# EasyEDA Pro project 8CH_ADC_CAPTURE_CARD.epro, board SMA
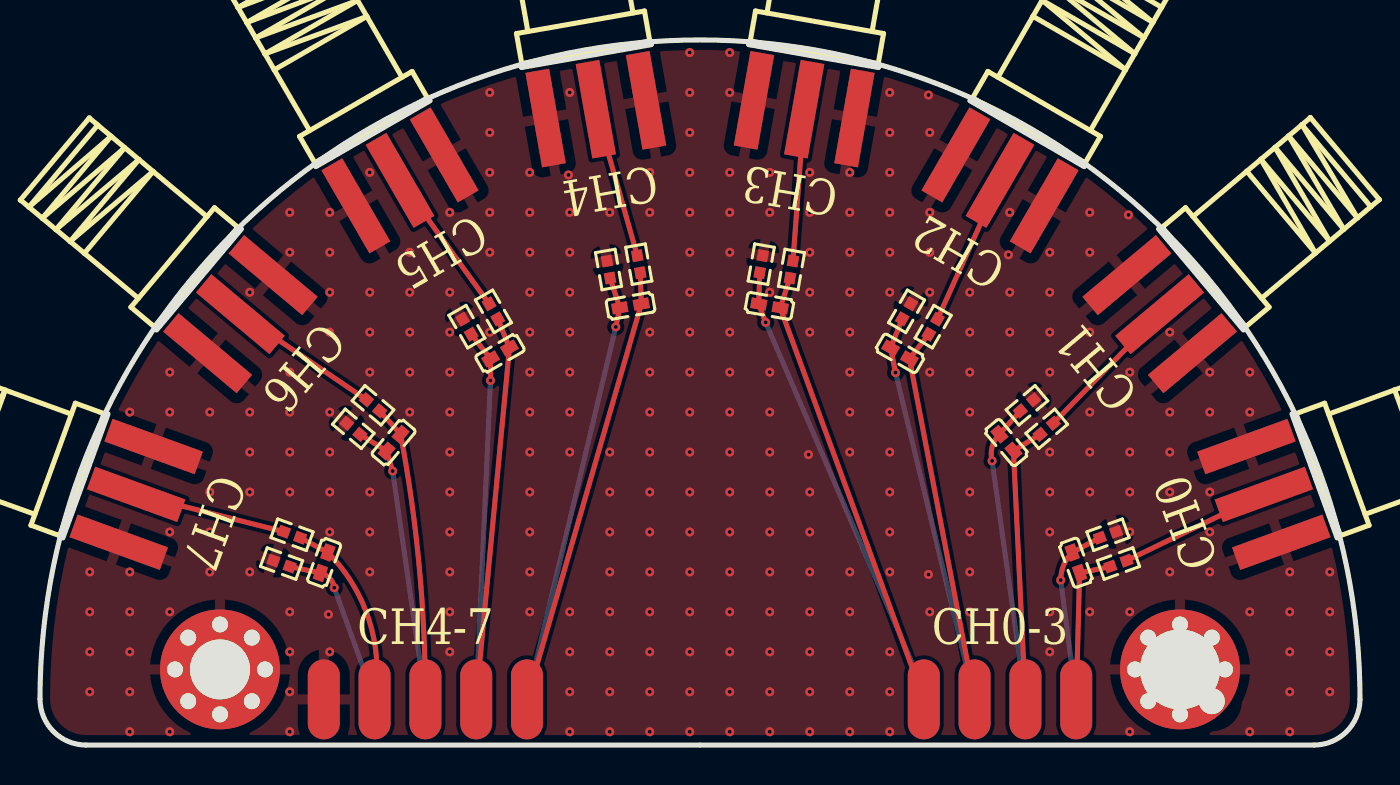
[diagram p14: board, top side]
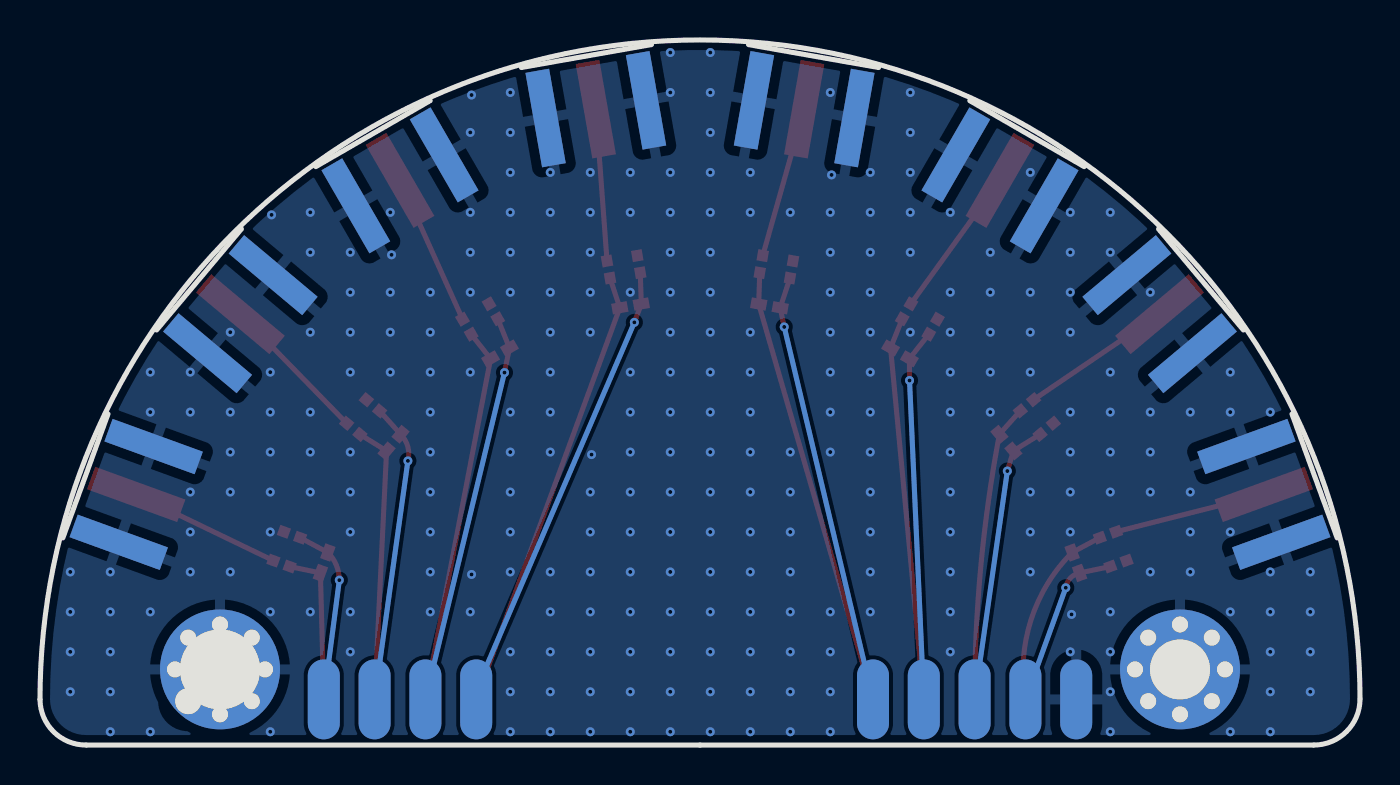
[diagram p15: board, bottom side, seen from below]

Outline 66 x 35.3 mm; copper layers: Top Layer, Inner9, Inner10, Inner11, Inner12, Inner13, Inner14, Inner15, Inner16, Inner17, Inner18, Inner19, Inner20, Inner21, Inner22, Inner23, Inner24, Inner25, Inner26, Inner27, Inner28, Inner29, Inner30, Bottom Layer. Coordinates in mm from the lower left corner of the outline.
Outline path: 0,2.3 arc(33.01,35.3) 66,2.29 arc(65.32,0.67) 63.69,0 2.31,0 arc(0.68,0.67) 0,2.3
Stack: Top Layer 0.035mm / Dielectric1 1.51mm FR4 er 4.5 / Bottom Layer 0.035mm

## Design rules (mm)
template: 自定义配置
spacing copperThickness1oz (default): track to track 0.102, other pairs 0.152 to 0.3
spacing copperThickness2oz: track to track 0.203, other pairs 0.152 to 0.3
track width copperThickness1oz (default): min 0.127, default 0.254, max 2.54
track width copperThickness2oz: min 0.203, default 0.254, max 2.54
differential pair differentialPair (default): width min 0.127, default 0.254, max 2.54; gap min 0.152, default 0.152
via viaSize (default): diameter min 0.4, default 0.45, max 10; hole min 0.2, default 0.2, max 6.3

## Placement (name value [footprint] x y rotation side)
C1  2nF  [C0402]  51.79 9.13 290 top
C2  2nF  [C0402]  48.32 15.14 310 top
C3  2nF  [C0402]  43 19.61 330 top
C4  2nF  [C0402]  36.47 21.98 350 top
C5  2nF  [C0402]  29.53 21.98 10 top
C6  2nF  [C0402]  23 19.61 30 top
C7  2nF  [C0402]  17.68 15.14 50 top
C8  2nF  [C0402]  14.21 9.13 70 top
H1  PZ254V-12-8P  [HDR-TH_8P-P2.54-V-M-R2-C4-S2.54]  48 2.29 180 top
H2  PZ254V-12-10P  [HDR-TH_10P-P2.54-V-M-R2-C5-S2.54]  19.27 2.29 180 top
NOREF  -  [Pad_e3119]  6.75 3.79 45 top
NOREF#2  -  [Pad_e3107]  57 3.79 0 top
NOREF#3  -  [Pad_e3126]  7.41 2.2 45 top
NOREF#4  -  [Pad_e3114]  57 1.54 45 top
NOREF#5  -  [Pad_e3112]  57 6.04 45 top
NOREF#6  -  [Pad_e3125]  9 1.54 45 top
NOREF#7  -  [Pad_e3116]  55.41 2.2 45 top
NOREF#8  -  [Pad_e3109]  9 3.79 0 top
NOREF#9  -  [Pad_e3110]  58.59 2.2 45 top
NOREF#10  -  [Pad_e3121]  9 6.04 45 top
NOREF#11  -  [Pad_e3120]  7.41 5.38 45 top
NOREF#12  -  [Pad_e3117]  59.25 3.79 45 top
NOREF#13  -  [Pad_e3122]  10.59 5.38 45 top
NOREF#14  -  [Pad_e3123]  11.25 3.79 45 top
NOREF#15  -  [Pad_e3113]  55.41 5.38 45 top
NOREF#16  -  [Pad_e3124]  10.59 2.2 45 top
NOREF#17  -  [Pad_e3118]  58.59 5.38 45 top
NOREF#18  -  [Pad_e3115]  54.75 3.79 45 top
R1  330Ω  [R0402]  53.92 9.08 200 top
R2  330Ω  [R0402]  53.4 10.53 200 top
R3  330Ω  [R0402]  50.34 15.83 220 top
R4  330Ω  [R0402]  49.35 17.01 220 top
R5  330Ω  [R0402]  44.66 20.94 240 top
R6  330Ω  [R0402]  43.33 21.71 240 top
R7  330Ω  [R0402]  37.57 23.81 260 top
R8  330Ω  [R0402]  36.06 24.07 260 top
R9  330Ω  [R0402]  29.94 24.07 280 top
R10  330Ω  [R0402]  28.43 23.81 280 top
R11  330Ω  [R0402]  22.67 21.71 300 top
R12  330Ω  [R0402]  21.34 20.94 300 top
R13  330Ω  [R0402]  16.65 17.01 320 top
R14  330Ω  [R0402]  15.66 15.83 320 top
R15  330Ω  [R0402]  12.6 10.53 340 top
R16  330Ω  [R0402]  12.08 9.08 340 top
RF1  BWSMA-KE-P001  [SMA-SMD_BWSMA-KE-P001]  61.19 12.55 20 top
RF2  BWSMA-KE-P001  [SMA-SMD_BWSMA-KE-P001]  55.98 21.57 40 top
RF3  BWSMA-KE-P001  [SMA-SMD_BWSMA-KE-P001]  48 28.27 60 top
RF4  BWSMA-KE-P001  [SMA-SMD_BWSMA-KE-P001]  38.21 31.83 80 top
RF5  BWSMA-KE-P001  [SMA-SMD_BWSMA-KE-P001]  27.79 31.83 100 top
RF6  BWSMA-KE-P001  [SMA-SMD_BWSMA-KE-P001]  18 28.27 120 top
RF7  BWSMA-KE-P001  [SMA-SMD_BWSMA-KE-P001]  10.02 21.57 140 top
RF8  BWSMA-KE-P001  [SMA-SMD_BWSMA-KE-P001]  4.81 12.55 160 top

## Footprints (pads in the part's own frame, mm; a bottom-side part is the same pattern mirrored in y, then rotated)
C0402
  rect 0.79x0.54 smd: 1(-0.545,0) 2(0.545,0)
HDR-TH_8P-P2.54-V-M-R2-C4-S2.54
  oval 1.6x4 smd: 1(-3.81,0) 3(-1.27,0) 5(1.27,0) 7(3.81,0)
  oval 1.6x4 smd far side: 2(-3.81,0) 4(-1.27,0) 6(1.27,0) 8(3.81,0)
HDR-TH_10P-P2.54-V-M-R2-C5-S2.54
  oval 1.6x4 smd: 1(-5.08,0) 3(-2.54,0) 5(0,0) 7(2.54,0) 9(5.08,0)
  oval 1.6x4 smd far side: 2(-5.08,0) 4(-2.54,0) 6(0,0) 8(2.54,0) 10(5.08,0)
Pad_e3107
  round 6 hole 4x3: 11(0,0)
Pad_e3109
  round 6 hole 3: 11(0,0)
Pad_e3110
  round 1.3 hole 3x0.8: 11(0,0)
Pad_e3112
  round 1.3 hole 0.8: 11(0,0)
Pad_e3113
  round 1.3 hole 0.8: 11(0,0)
Pad_e3114
  round 1.3 hole 0.8: 11(0,0)
Pad_e3115
  round 1.3 hole 0.8: 11(0,0)
Pad_e3116
  round 1.3 hole 0.8: 11(0,0)
Pad_e3117
  round 1.3 hole 0.8: 11(0,0)
Pad_e3118
  round 1.3 hole 0.8: 11(0,0)
Pad_e3119
  round 1.3 hole 0.8: 11(0,0)
Pad_e3120
  round 1.3 hole 0.8: 11(0,0)
Pad_e3121
  round 1.3 hole 0.8: 11(0,0)
Pad_e3122
  round 1.3 hole 0.8: 11(0,0)
Pad_e3123
  round 1.3 hole 0.8: 11(0,0)
Pad_e3124
  round 1.3 hole 0.8: 11(0,0)
Pad_e3125
  round 1.3 hole 0.8: 11(0,0)
Pad_e3126
  round 1.3 hole 0.8: 11(0,0)
R0402
  rect 0.566x0.54 smd: 1(-0.433,0) 2(0.433,0)
SMA-SMD_BWSMA-KE-P001
  rect 4.8x1.2 smd: 1(0,-2.55) 2(0,2.55) 5(0,0)
  rect 4.8x1.2 smd far side: 3(0,2.55) 4(0,-2.55)

## Nets
As in the schematic, except:
AGND: H2.9 H2.10 NOREF.11 NOREF#2.11 NOREF#3.11 NOREF#4.11 NOREF#5.11 NOREF#6.11 NOREF#7.11 NOREF#8.11 NOREF#9.11 NOREF#10.11 NOREF#11.11 NOREF#12.11 NOREF#13.11 NOREF#14.11 NOREF#15.11 NOREF#16.11 NOREF#17.11 NOREF#18.11 R2.1 R4.1 R6.1 R8.1 R10.1 R12.1 R14.1 R16.1 RF1.1 RF1.2 RF1.3 RF1.4 RF2.1 RF2.2 RF2.3 RF2.4 RF3.1 RF3.2 RF3.3 RF3.4 RF4.1 RF4.2 RF4.3 RF4.4 RF5.1 RF5.2 RF5.3 RF5.4 RF6.1 RF6.2 RF6.3 RF6.4 RF7.1 RF7.2 RF7.3 RF7.4 RF8.1 RF8.2 RF8.3 RF8.4

## Via types
v1: diameter 0.45, hole 0.2, Top Layer to Bottom Layer, 285 vias

## Routing (per net, layer and track width the routed paths; a pad name or vN(x,y) marks a point on that pad's centre or on a via; arc(x,y) is an arc through that point)
AGND:
  vias: v1(2.49,8.67) v1(2.49,6.67) v1(2.49,4.67) v1(2.49,2.67) v1(4.49,16.67) v1(4.49,8.67) v1(4.49,6.67) v1(4.49,4.67) v1(4.49,2.67) v1(4.49,0.67) v1(6.49,18.67) v1(6.49,16.67) v1(6.49,10.67) v1(6.49,6.67) v1(6.49,0.67) v1(8.49,16.67) v1(8.49,12.67) v1(8.49,10.67) v1(8.49,8.67) v1(10.49,22.67) v1(10.49,16.67) v1(10.49,14.67) v1(10.49,12.67) v1(10.49,8.67) v1(12.49,26.67) v1(12.49,24.67) v1(12.49,18.67) v1(12.49,16.67) v1(12.49,14.67) v1(12.49,12.67) v1(12.49,6.67) v1(12.49,4.67) v1(12.49,2.67) v1(12.49,0.67) v1(14.42,6.54) v1(14.49,26.67) v1(14.49,24.67) v1(14.49,22.67) v1(14.49,20.67) v1(14.49,16.67) v1(14.49,14.67) v1(14.49,12.67) v1(14.49,10.67) v1(14.49,4.67) v1(16.49,28.67) v1(16.49,22.67) v1(16.49,20.67) v1(16.49,18.67) v1(16.49,12.67) v1(16.49,10.67) v1(16.49,8.67) v1(18.49,24.67) v1(18.49,22.67) v1(18.49,20.67) v1(18.49,18.67) v1(18.49,16.67) v1(20.49,26.67) v1(20.49,22.67) v1(20.49,20.67) v1(20.49,18.67) v1(20.49,16.67) v1(20.49,14.67) v1(20.49,12.67) v1(20.49,10.67) v1(20.49,8.67) v1(20.49,6.67) v1(20.49,4.67) v1(22.49,32.67) v1(22.49,30.67) v1(22.49,28.67) v1(22.49,26.67) v1(22.49,24.67) v1(22.49,20.67) v1(24.49,28.67) v1(24.49,26.67) v1(24.49,24.67) v1(24.49,22.67) v1(24.49,20.67) v1(24.49,18.67) v1(24.49,16.67) v1(24.49,14.67) v1(24.49,12.67) v1(24.49,10.67) v1(24.49,8.67) v1(24.49,6.67) v1(26.42,28.54) v1(26.49,32.67) v1(26.49,26.67) v1(26.49,24.67) v1(26.49,22.67) v1(26.49,20.67) v1(26.49,18.67) v1(26.49,16.67) v1(26.49,14.67) v1(26.49,6.67) v1(26.49,4.67) v1(26.49,2.67) v1(26.49,0.67) v1(28.49,26.67) v1(28.49,14.67) v1(28.49,12.67) v1(28.49,10.67) v1(28.49,8.67) v1(28.49,6.67) v1(28.49,4.67) v1(28.49,2.67) v1(28.49,0.67) v1(30.49,28.67) v1(30.49,26.67) v1(30.49,20.67) v1(30.49,18.67) v1(30.49,16.67) v1(30.49,14.67) v1(30.49,12.67) v1(30.49,10.67) v1(30.49,8.67) v1(30.49,6.67) v1(30.49,4.67) v1(30.49,2.67) v1(30.49,0.67) v1(32.49,34.67) v1(32.49,32.67) v1(32.49,30.67) v1(32.49,28.67) v1(32.49,26.67) v1(32.49,24.67) v1(32.49,22.67) v1(32.49,20.67) v1(32.49,18.67) v1(32.49,16.67) v1(32.49,14.67) v1(32.49,12.67) v1(32.49,10.67) v1(32.49,8.67) v1(32.49,6.67) v1(32.49,4.67) v1(32.49,2.67) v1(32.49,0.67) v1(34.49,34.67) v1(34.49,32.67) v1(34.49,28.67) v1(34.49,26.67) v1(34.49,24.67) v1(34.49,22.67) v1(34.49,20.67) v1(34.49,18.67) v1(34.49,16.67) v1(34.49,14.67) v1(34.49,12.67) v1(34.49,10.67) v1(34.49,8.67) v1(34.49,6.67) v1(34.49,4.67) v1(34.49,2.67) v1(34.49,0.67) v1(36.49,28.67) v1(36.49,26.67) v1(36.49,22.67) v1(36.49,18.67) v1(36.49,16.67) v1(36.49,14.67) v1(36.49,12.67) v1(36.49,10.67) v1(36.49,8.67) v1(36.49,6.67) v1(36.49,4.67) v1(36.49,2.67) v1(36.49,0.67) v1(38.42,14.54) v1(38.49,28.67) v1(38.49,26.67) v1(38.49,24.67) v1(38.49,22.67) v1(38.49,20.67) v1(38.49,12.67) v1(38.49,10.67) v1(38.49,8.67) v1(38.49,6.67) v1(38.49,4.67) v1(38.49,2.67) v1(38.49,0.67) v1(40.49,28.67) v1(40.49,26.67) v1(40.49,24.67) v1(40.49,22.67) v1(40.49,20.67) v1(40.49,18.67) v1(40.49,16.67) v1(40.49,14.67) v1(40.49,8.67) v1(40.49,6.67) v1(40.49,4.67) v1(40.49,2.67) v1(40.49,0.67) v1(42.49,32.67) v1(42.49,30.67) v1(42.49,28.67) v1(42.49,26.67) v1(42.49,24.67) v1(42.49,22.67) v1(42.49,16.67) v1(42.49,14.67) v1(42.49,12.67) v1(42.49,10.67) v1(42.49,8.67) v1(42.49,4.67) v1(42.49,2.67) v1(42.49,0.67) v1(44.42,32.54) v1(44.42,8.54) v1(44.49,30.67) v1(44.49,26.67) v1(44.49,24.67) v1(44.49,22.67) v1(44.49,18.67) v1(44.49,6.67) v1(46.49,22.67) v1(46.49,20.67) v1(46.49,18.67) v1(46.49,16.67) v1(46.49,14.67) v1(46.49,12.67) v1(46.49,10.67) v1(46.49,8.67) v1(46.49,6.67) v1(48.42,24.54) v1(48.49,26.67) v1(48.49,22.67) v1(48.49,20.67) v1(48.49,18.67) v1(50.49,24.67) v1(50.49,22.67) v1(50.49,20.67) v1(50.49,18.67) v1(50.49,14.67) v1(50.49,12.67) v1(50.49,10.67) v1(50.49,6.67) v1(50.49,4.67) v1(52.49,26.67) v1(52.49,24.67) v1(52.49,20.67) v1(52.49,16.67) v1(52.49,14.67) v1(52.49,12.67) v1(52.49,6.67) v1(54.42,26.54) v1(54.49,18.67) v1(54.49,16.67) v1(54.49,14.67) v1(54.49,12.67) v1(54.49,10.67) v1(54.49,6.67) v1(54.49,0.67) v1(56.49,20.67) v1(56.49,16.67) v1(56.49,14.67) v1(56.49,12.67) v1(56.49,8.67) v1(58.49,18.67) v1(58.49,16.67) v1(58.49,12.67) v1(58.49,10.67) v1(58.49,8.67) v1(60.49,18.67) v1(60.49,16.67) v1(60.49,6.67) v1(60.49,0.67) v1(62.49,8.67) v1(62.49,6.67) v1(62.49,4.67) v1(62.49,2.67) v1(62.49,0.67) v1(64.49,8.67) v1(64.49,6.67) v1(64.49,4.67) v1(64.49,2.67)
AGND_CH0: length 9.1
  Top Layer w0.254: R2.2 C1.1 arc(51.18,9) v1(51.03,8.25)
  Bottom Layer w0.254: v1(51.03,8.25) H1.2
AGND_CH1: length 15.1
  Top Layer w0.254: R4.2 C2.1 arc(47.61,14.94) v1(47.6,14.22)
  Bottom Layer w0.254: v1(47.6,14.22) H1.4
AGND_CH2: length 19.7
  Top Layer w0.254: v1(42.78,18.64) C3.1 R6.2
  Bottom Layer w0.254: H1.6 v1(42.78,18.64)
AGND_CH3: length 23
  Top Layer w0.254: R8.2 35.94,22.08 v1(36.28,21.16)
  Bottom Layer w0.254: 44.36,2.35 v1(36.28,21.16)
AGND_CH4: length 21.7
  Top Layer w0.254: v1(28.79,20.93) C5.1 28.5,23.38
  Bottom Layer w0.254: H2.2 v1(28.79,20.93)
AGND_CH5: length 18.6
  Top Layer w0.254: v1(22.52,18.25) C6.1 R12.2
  Bottom Layer w0.254: H2.4 v1(22.52,18.25)
AGND_CH6: length 14.2
  Top Layer w0.254: R14.2 C7.1 v1(17.63,13.72)
  Bottom Layer w0.254: H2.6 v1(17.63,13.72)
AGND_CH7: length 8.6
  Top Layer w0.254: R16.2 C8.1 arc(14.48,8.35) v1(14.71,7.87)
  Bottom Layer w0.254: H2.8 v1(14.71,7.87)
ADC_CH0: length 7.9
  Top Layer w0.254: R1.2 C1.2 H1.1
ADC_CH1: length 14
  Top Layer w0.254: H1.3 C2.2 R3.2
ADC_CH2: length 18.9
  Top Layer w0.254: R5.2 C3.2 H1.5
ADC_CH3: length 22.4
  Top Layer w0.254: H1.7 C4.2 37.5,23.38
ADC_CH4: length 22.2
  Top Layer w0.254: R9.2 30.06,22.08 H2.1
ADC_CH5: length 19.2
  Top Layer w0.254: R11.2 C6.2 H2.3
ADC_CH6: length 14.9
  Top Layer w0.254: R13.2 C7.2 arc(18.96,8.95) H2.5
ADC_CH7: length 9.6
  Top Layer w0.254: R15.2 C8.2 arc(16.46,6.25) H2.7
$1N1025: length 7.6
  Top Layer w0.254: R1.1 RF1.5
$1N1171: length 7.6
  Top Layer w0.254: 50.67,16.11 RF2.5
$1N1296: length 7.6
  Top Layer w0.254: R5.1 RF3.5
$1N1421: length 7.6
  Top Layer w0.254: 37.65,24.23 RF4.5
$1N2146: length 7.6
  Top Layer w0.254: 29.86,24.5 RF5.5
$1N2158: length 7.6
  Top Layer w0.254: R11.1 RF6.5
$1N2170: length 7.6
  Top Layer w0.254: R13.1 RF7.5
$1N2182: length 7.6
  Top Layer w0.254: R15.1 RF8.5

## Copper pours and planes (outline as drawn; the poured copper is in the pictures)
AGND on Top Layer: -11.58,50.42 77.45,50.42 77.45,-5.46 -11.58,-5.46
AGND on Bottom Layer: -11.51,50.55 77.51,50.55 77.51,-5.33 -11.51,-5.33

## Text on the board
Top Silkscreen Layer: CH4-7 | CH0-3 | CH0 | CH1 | CH2 | CH3 | CH4 | CH5 | CH6 | CH7
